# Altium project autowatering.PrjPcb
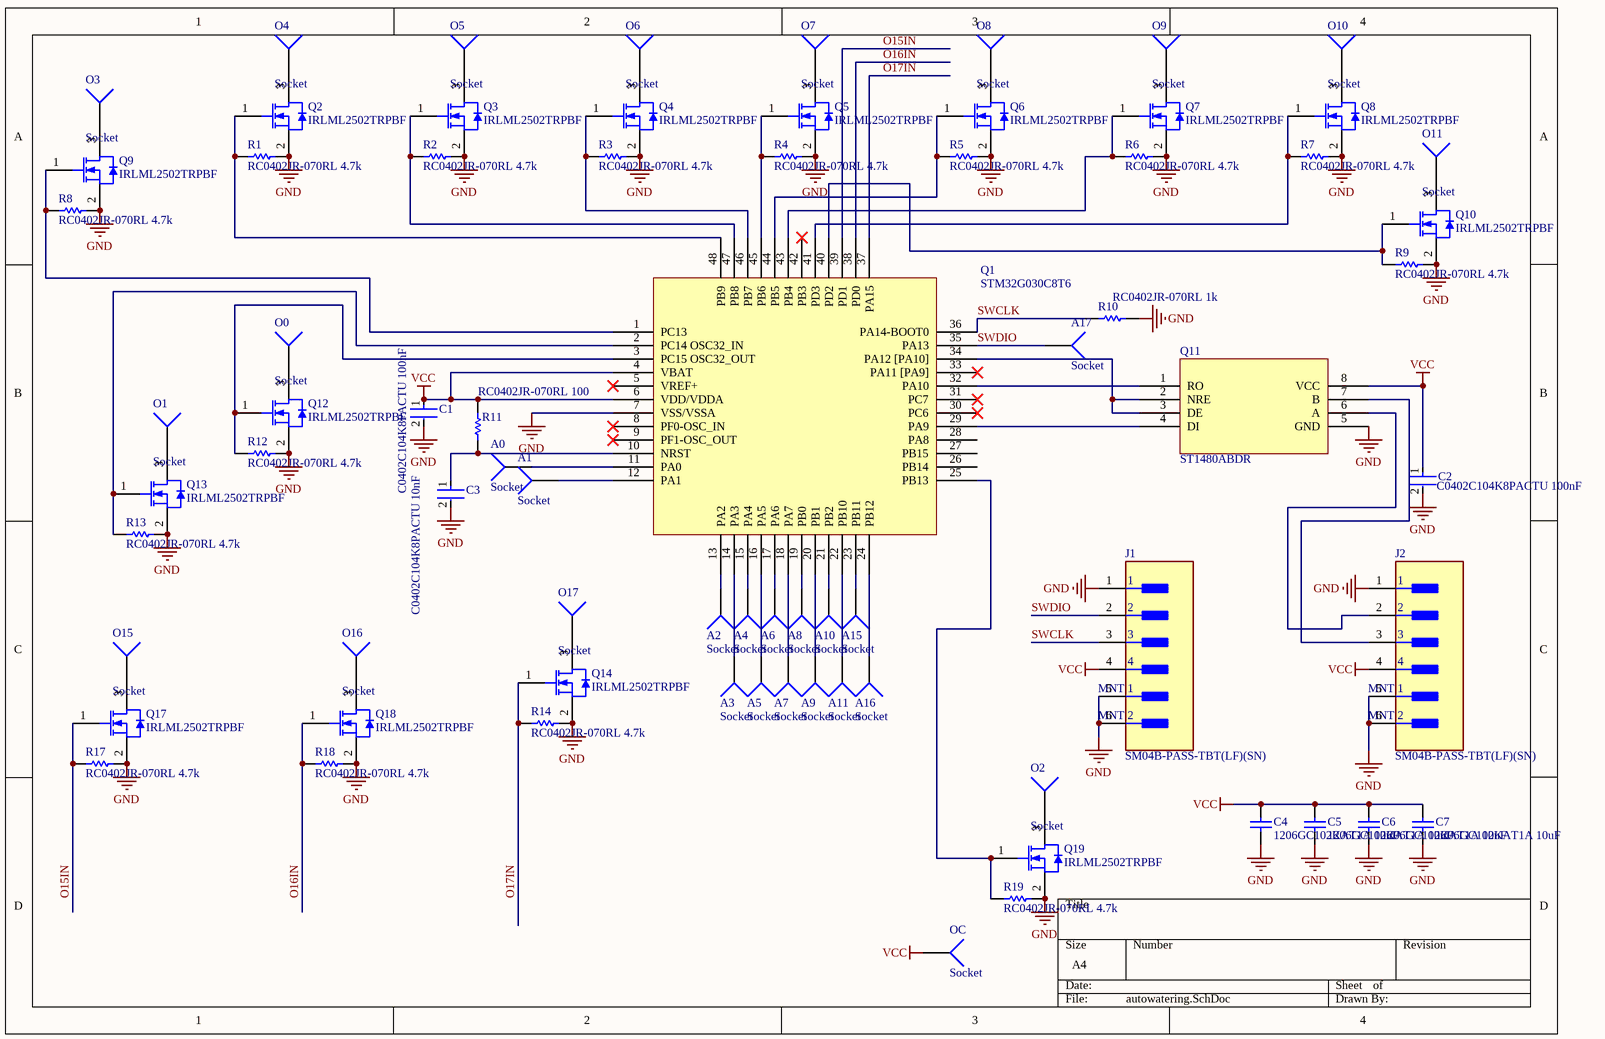
[diagram p0: autowatering.SchDoc]
1 sheet, 74 parts. Net scope: global (net labels, ports and power ports of the same name join across sheets).
Board file: PCB.PcbDoc

## Sheet autowatering.SchDoc
size A4; SheetNumber: 1; SheetTotal: 1

### Parts
A0  Socket  [PIN1]
A1  Socket  [PIN1]
A2  Socket  [PIN1]
A3  Socket  [PIN1]
A4  Socket  [PIN1]
A5  Socket  [PIN1]
A6  Socket  [PIN1]
A7  Socket  [PIN1]
A8  Socket  [PIN1]
A9  Socket  [PIN1]
A10  Socket  [PIN1]
A11  Socket  [PIN1]
A15  Socket  [PIN1]
A16  Socket  [PIN1]
A17  Socket  [PIN1]
C1  C0402C104K8PACTU 100nF  [FP-C0402-BB-MFG]
C2  C0402C104K8PACTU 100nF  [FP-C0402-BB-MFG]
C3  C0402C104K8PACTU 10nF  [FP-C0402-BB-MFG]
C4  1206GC102KAT1A 10uF  [AVX-1206-2_L]
C5  1206GC102KAT1A 10uF  [AVX-1206-2_L]
C6  1206GC102KAT1A 10uF  [AVX-1206-2_L]
C7  1206GC102KAT1A 10uF  [AVX-1206-2_L]
J1  SM04B-PASS-TBT(LF)(SN)  [FP-SM04B-PASS-TBT_LF_SN-MFG]
J2  SM04B-PASS-TBT(LF)(SN)  [FP-SM04B-PASS-TBT_LF_SN-MFG]
O0  Socket  [PIN1]
O1  Socket  [PIN1]
O2  Socket  [PIN1]
O3  Socket  [PIN1]
O4  Socket  [PIN1]
O5  Socket  [PIN1]
O6  Socket  [PIN1]
O7  Socket  [PIN1]
O8  Socket  [PIN1]
O9  Socket  [PIN1]
O10  Socket  [PIN1]
O11  Socket  [PIN1]
O15  Socket  [PIN1]
O16  Socket  [PIN1]
O17  Socket  [PIN1]
OC  Socket  [PIN1]
Q1  STM32G030C8T6  [LQFP-48]
Q2  IRLML2502TRPBF  [INTR-SOT-23-3_V]
Q3  IRLML2502TRPBF  [INTR-SOT-23-3_V]
Q4  IRLML2502TRPBF  [INTR-SOT-23-3_V]
Q5  IRLML2502TRPBF  [INTR-SOT-23-3_V]
Q6  IRLML2502TRPBF  [INTR-SOT-23-3_V]
Q7  IRLML2502TRPBF  [INTR-SOT-23-3_V]
Q8  IRLML2502TRPBF  [INTR-SOT-23-3_V]
Q9  IRLML2502TRPBF  [INTR-SOT-23-3_V]
Q10  IRLML2502TRPBF  [INTR-SOT-23-3_V]
Q11  ST1480ABDR  [8S1_N]
Q12  IRLML2502TRPBF  [INTR-SOT-23-3_V]
Q13  IRLML2502TRPBF  [INTR-SOT-23-3_V]
Q14  IRLML2502TRPBF  [INTR-SOT-23-3_V]
Q17  IRLML2502TRPBF  [INTR-SOT-23-3_V]
Q18  IRLML2502TRPBF  [INTR-SOT-23-3_V]
Q19  IRLML2502TRPBF  [INTR-SOT-23-3_V]
R1  RC0402JR-070RL 4.7k  [RESC1005X40X25NL05T10]
R2  RC0402JR-070RL 4.7k  [RESC1005X40X25NL05T10]
R3  RC0402JR-070RL 4.7k  [RESC1005X40X25NL05T10]
R4  RC0402JR-070RL 4.7k  [RESC1005X40X25NL05T10]
R5  RC0402JR-070RL 4.7k  [RESC1005X40X25NL05T10]
R6  RC0402JR-070RL 4.7k  [RESC1005X40X25NL05T10]
R7  RC0402JR-070RL 4.7k  [RESC1005X40X25NL05T10]
R8  RC0402JR-070RL 4.7k  [RESC1005X40X25NL05T10]
R9  RC0402JR-070RL 4.7k  [RESC1005X40X25NL05T10]
R10  RC0402JR-070RL 1k  [RESC1005X40X25NL05T10]
R11  RC0402JR-070RL 100  [RESC1005X40X25NL05T10]
R12  RC0402JR-070RL 4.7k  [RESC1005X40X25NL05T10]
R13  RC0402JR-070RL 4.7k  [RESC1005X40X25NL05T10]
R14  RC0402JR-070RL 4.7k  [RESC1005X40X25NL05T10]
R17  RC0402JR-070RL 4.7k  [RESC1005X40X25NL05T10]
R18  RC0402JR-070RL 4.7k  [RESC1005X40X25NL05T10]
R19  RC0402JR-070RL 4.7k  [RESC1005X40X25NL05T10]

### Nets
GND: C1.2 C2.2 C3.2 C4.1 C5.1 C6.1 C7.1 J1.1 J1.5(MNT_1) J1.6(MNT_2) J2.1 J2.5(MNT_1) J2.6(MNT_2) Q1.7(VSS/VSSA) Q2.2(S) Q3.2(S) Q4.2(S) Q5.2(S) Q6.2(S) Q7.2(S) Q8.2(S) Q9.2(S) Q10.2(S) Q11.5(GND) Q12.2(S) Q13.2(S) Q14.2(S) Q17.2(S) Q18.2(S) Q19.2(S) R1.1 R2.1 R3.1 R4.1 R5.1 R6.1 R7.1 R8.1 R9.1 R10.2 R12.1 R13.1 R14.1 R17.1 R18.1 R19.1
VCC: C1.1 C2.1 C4.2 C5.2 C6.2 C7.2 J1.4 J2.4 OC.1 Q1.4(VBAT) Q1.6(VDD/VDDA) Q11.8(VCC) R11.2
O15IN: Q1.39(PD1) Q17.1(G) R17.2
O16IN: Q1.38(PD0) Q18.1(G) R18.2
O17IN: Q1.37(PA15) Q14.1(G) R14.2
SWCLK: J1.3 Q1.36(PA14-BOOT0) R10.1
SWDIO: A17.1 J1.2 Q1.35(PA13)
NetA0_1: A0.1 Q1.11(PA0)
NetA1_1: A1.1 Q1.12(PA1)
NetA2_1: A2.1 Q1.13(PA2)
NetA3_1: A3.1 Q1.14(PA3)
NetA4_1: A4.1 Q1.15(PA4)
NetA5_1: A5.1 Q1.16(PA5)
NetA6_1: A6.1 Q1.17(PA6)
NetA7_1: A7.1 Q1.18(PA7)
NetA8_1: A8.1 Q1.19(PB0)
NetA9_1: A9.1 Q1.20(PB1)
NetA10_1: A10.1 Q1.21(PB2)
NetA11_1: A11.1 Q1.22(PB10)
NetA15_1: A15.1 Q1.23(PB11)
NetA16_1: A16.1 Q1.24(PB12)
NetC3_1: C3.1 Q1.10(NRST) R11.1
NetJ2_2: J2.2 Q11.6(A)
NetJ2_3: J2.3 Q11.7(B)
NetO0_1: O0.1 Q12.3(D)
NetO1_1: O1.1 Q13.3(D)
NetO2_1: O2.1 Q19.3(D)
NetO3_1: O3.1 Q9.3(D)
NetO4_1: O4.1 Q2.3(D)
NetO5_1: O5.1 Q3.3(D)
NetO6_1: O6.1 Q4.3(D)
NetO7_1: O7.1 Q5.3(D)
NetO8_1: O8.1 Q6.3(D)
NetO9_1: O9.1 Q7.3(D)
NetO10_1: O10.1 Q8.3(D)
NetO11_1: O11.1 Q10.3(D)
NetO15_1: O15.1 Q17.3(D)
NetO16_1: O16.1 Q18.3(D)
NetO17_1: O17.1 Q14.3(D)
NetQ1_1: Q1.1(PC13) Q9.1(G) R8.2
NetQ1_2: Q1.2(PC14_OSC32_IN) Q13.1(G) R13.2
NetQ1_3: Q1.3(PC15_OSC32_OUT) Q12.1(G) R12.2
NetQ1_25: Q1.25(PB13) Q19.1(G) R19.2
NetQ1_29: Q1.29(PA9) Q11.4(DI)
NetQ1_32: Q1.32(PA10) Q11.1(RO)
NetQ1_34: Q1.34(PA12_[PA10]) Q11.2(NRE) Q11.3(DE)
NetQ1_40: Q1.40(PD2) Q10.1(G) R9.2
NetQ1_41: Q1.41(PD3) Q8.1(G) R7.2
NetQ1_43: Q1.43(PB4) Q7.1(G) R6.2
NetQ1_44: Q1.44(PB5) Q6.1(G) R5.2
NetQ1_45: Q1.45(PB6) Q5.1(G) R4.2
NetQ1_46: Q1.46(PB7) Q4.1(G) R3.2
NetQ1_47: Q1.47(PB8) Q3.1(G) R2.2
NetQ1_48: Q1.48(PB9) Q2.1(G) R1.2

Not connected (* = marked no-connect by the designer): Q1 5(VREF+)* 8(PF0-OSC_IN)* 9(PF1-OSC_OUT)* 26(PB14) 27(PB15) 28(PA8) 30(PC6)* 31(PC7)* 33(PA11_[PA9])* 42(PB3)*

### Library data of the parts
C1-C3 = CMP-2008-02046-2: CAP CER 0.1UF 10V X5R 0402; Manufacturer: Kemet; Material: Ceramic; Capacitance: 0.10 μF; Temperature Coefficient: 15%; Tolerance: 0.1; Value: 0.10 μF; Package: C0402-BB; Temperature: -55°C to +125°C; ComponentLink2Description: Datasheet; Temperature Characteristic: X5R; Device Class L1: Passive Components; Height: 0.55mm; Lead Free: Yes; ComponentLink2URL: https://content.kemet.com/datasheets/KEM_C1002_X7R_SMD.pdf; Device Class L2: Capacitors; Temperature Range Low: -55°C; Temperature Range High: +125°C; RoHS: TRUE; Octopart: https://octopart.com/c0402c104k8pactu-kemet-140039; Automotive: No; Mouser Description: Capacitor 100 nF 10 VDC 0402; Category: Cap; Voltage Rating: 10 V; Digikey Description: CAP CER 0.1UF 10V X5R 0402; Ipc Land Pattern Name: CAPC10050X50; Device Class L3: Ceramic Capacitors; Manufacturer Part Number: C0402C104K8PACTU
C4-C7 = CMP-2000-05468-1: Chip Capacitor, 1 nF, +/- 10%, -55 to 125 degC, 1206 (3216 Metric), RoHS, Tape and Reel; Manufacturer: AVX; Capacitance: 0.001uF; Dielectric: X7R; Voltage Rating DC: 2000V; Package Reference: 1206; Datasheet Version: 11/2010; Mounting Technology: SurfaceMount; Manufacturer URL: http://www.avx.com/; Tolerance: 10%; Tolerance (%): ±10%; PartNumber: 1206GC102KAT1A; Datasheet URL: https://datasheet.ciiva.com/11787/0900766b80ed4c37-11787781.pdf; Package Description: 2-Pin SMD, Body 3.4 x 1.8 mm; Case Size/Dimension: 1206; Rated Voltage: 2000V
J1 J2 = CMP-2000-07078-2: CONN HEADER SMD R/A 4POS 2MM; Manufacturer: JST; Voltage Rating: 250V; Current Rating: 3A; Conn Gender: Male; Conn Orientation: Right Angle; Number Of Contacts: 4; Height: 5.7mm; Contact Material: Tin; Device Class L2: Headers and Wire Housings; Number Of Rows: 1; Device Class L1: Connectors; RoHS: TRUE; Lead Free: Yes; Automotive: No; Digikey Description: CONN HEADER SMD R/A 4POS 2MM; Manufacturer Part Number: SM04B-PASS-TBT(LF)(SN); Temperature: -25°C to +85°C; Package: SM04B-PASS-TBT(LF)(SN); Temperature Range Low: -25°C; ComponentLink2Description: Datasheet; Temperature Range High: +85°C; Pitch: 2mm; ComponentLink2URL: http://www.jst-mfg.com/product/pdf/eng/ePA-F.pdf; Octopart: https://octopart.com/sm04b-pass-tbt%28lf%29%28sn%29-jst-3990422; Category: Conn; Device Class L3: unset
Q2-Q10 Q12-Q14 Q17-Q19 = CMP-2000-04985-1: N-Channel HEXFET(R) Power MOSFET, 20 V VDS, +/- 12 V VGS, 4.2 A, 3-Pin SOT23, RoHS, Tape and Reel; Manufacturer: International Rectifier; Drain-to-Source Voltage [Vdss]: 20V; Drain-Source On Resistance-Max: 0.045O; Qg Gate Charge: 8nC; Rated Power Dissipation: 1.25W; Package Reference: SOT-23-3; Manufacturer URL: http://internationalrectifier.com/; Package Description: 3-Pin Small Outline Transistor, Body 2.92 x 1.3 mm, Pitch 0.95 mm; Datasheet Version: Apr-14; Channel Type: N-Channel; Datasheet URL: https://datasheet.ciiva.com/6383/irlml2502pbf-6383216.pdf
R1-R14 R17-R19 = CMP-1011-00001-2: Manufacturer: Yageo / Phycomp; Part Number: RC0402JR-070RL
A0-A11 A15-A17 O0-O11 O15-O17 OC = Socket: LatestRevisionDate: 17-Jul-2002; LatestRevisionNote: Re-released for DXP Platform.; Publisher: Altium Limited